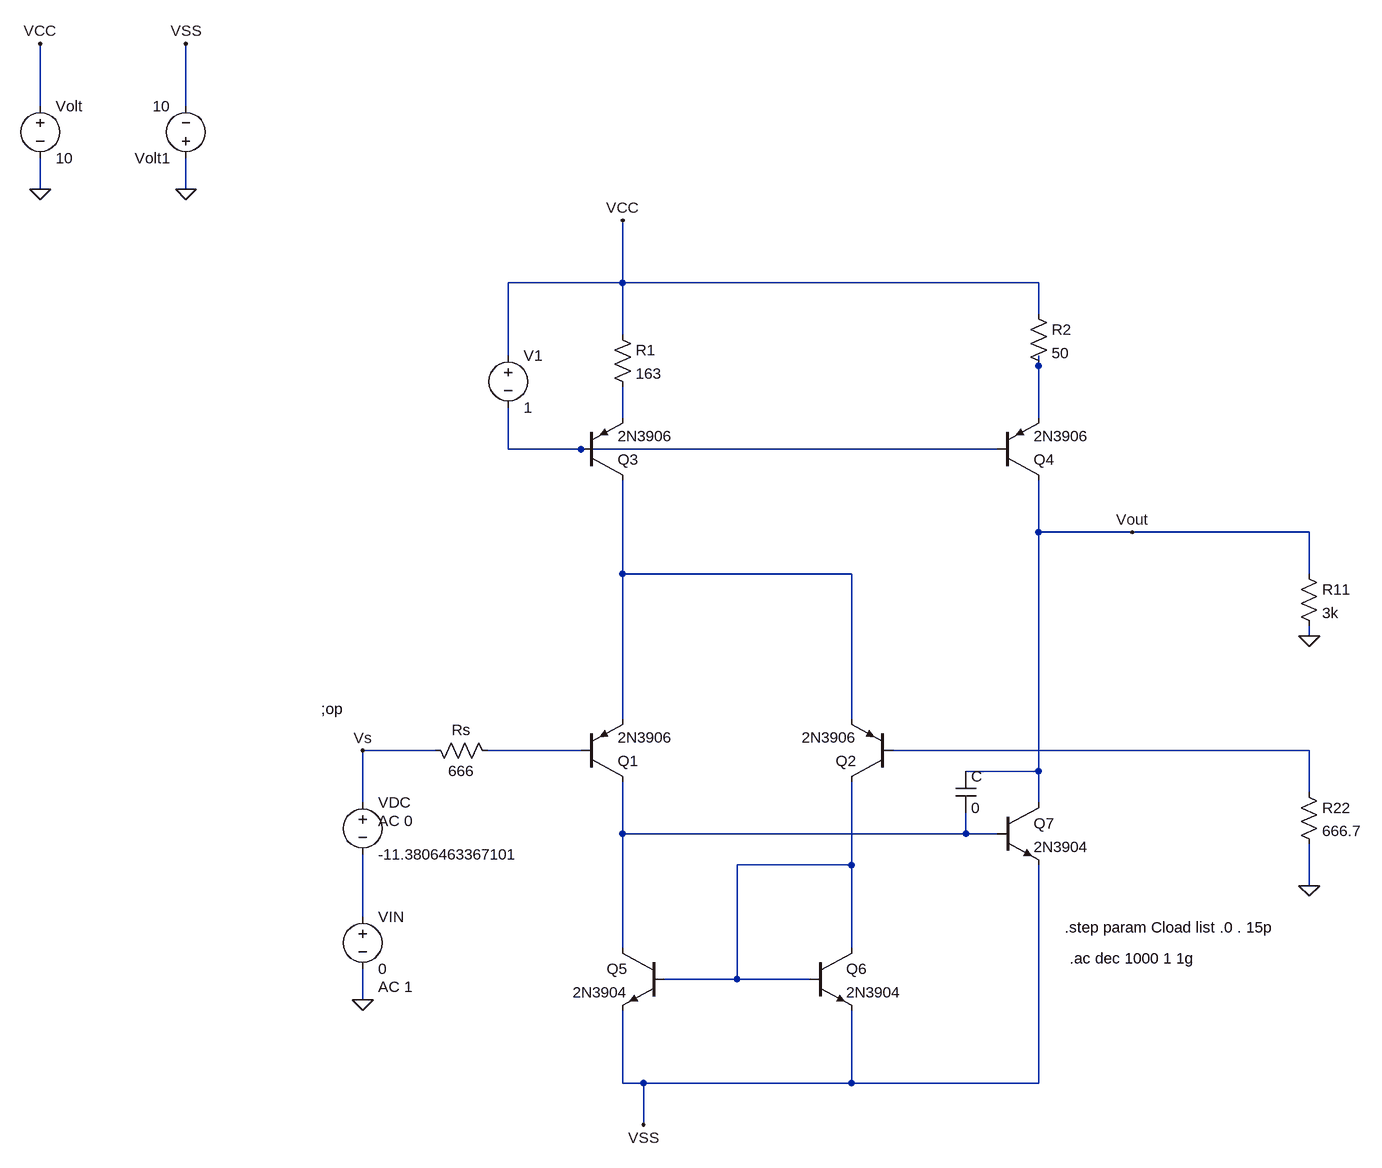
[diagram p0: schematic ASK3_open_loop.asc]
ASK3_open_loop.asc, the LTspice schematic file:
Version 4
SHEET 1 3348 680
WIRE -1056 -1232 -1056 -1328
WIRE -832 -1232 -832 -1328
WIRE -1056 -1104 -1056 -1152
WIRE -832 -1104 -832 -1152
WIRE -160 -960 -160 -1056
WIRE -160 -960 -336 -960
WIRE 480 -960 -160 -960
WIRE 480 -912 480 -960
WIRE -160 -880 -160 -960
WIRE -336 -848 -336 -960
WIRE 480 -832 480 -848
WIRE -160 -752 -160 -800
WIRE 480 -752 480 -832
WIRE -336 -704 -336 -768
WIRE -224 -704 -336 -704
WIRE 416 -704 -224 -704
WIRE 480 -576 480 -656
WIRE 624 -576 480 -576
WIRE 896 -576 624 -576
WIRE -160 -512 -160 -656
WIRE 192 -512 -160 -512
WIRE 896 -512 896 -576
WIRE 896 -416 896 -432
WIRE 896 -416 880 -416
WIRE -160 -288 -160 -512
WIRE 192 -288 192 -512
WIRE -448 -240 -560 -240
WIRE -224 -240 -368 -240
WIRE 896 -240 256 -240
WIRE 480 -208 480 -576
WIRE 480 -208 368 -208
WIRE 896 -176 896 -240
WIRE -560 -160 -560 -240
WIRE 480 -160 480 -208
WIRE -160 -112 -160 -192
WIRE 368 -112 368 -144
WIRE 368 -112 -160 -112
WIRE 416 -112 368 -112
WIRE 192 -64 192 -192
WIRE 192 -64 16 -64
WIRE 896 -32 896 -96
WIRE -560 16 -560 -80
WIRE -160 64 -160 -112
WIRE 192 64 192 -64
WIRE 16 112 16 -64
WIRE 16 112 -96 112
WIRE 128 112 16 112
WIRE -560 144 -560 96
WIRE -160 272 -160 160
WIRE -128 272 -160 272
WIRE 192 272 192 160
WIRE 192 272 -128 272
WIRE 480 272 480 -64
WIRE 480 272 192 272
WIRE -128 336 -128 272
FLAG -160 -1056 VCC
FLAG -560 144 0
FLAG -128 336 VSS
FLAG 896 -32 0
FLAG 624 -576 Vout
FLAG -1056 -1104 0
FLAG -1056 -1328 VCC
FLAG -832 -1104 0
FLAG -832 -1328 VSS
FLAG -560 -240 Vs
FLAG 896 -416 0
SYMBOL npn 128 64 R0
SYMATTR InstName Q6
SYMATTR Value 2N3904
SYMBOL npn -96 64 M0
SYMATTR InstName Q5
SYMATTR Value 2N3904
SYMBOL pnp 256 -192 R180
SYMATTR InstName Q2
SYMATTR Value 2N3906
SYMBOL pnp -224 -192 M180
SYMATTR InstName Q1
SYMATTR Value 2N3906
SYMBOL res -464 -256 M90
WINDOW 0 0 56 VBottom 2
WINDOW 3 32 56 VTop 2
SYMATTR InstName Rs
SYMATTR Value 666
SYMBOL pnp -224 -656 M180
SYMATTR InstName Q3
SYMATTR Value 2N3906
SYMBOL res -176 -896 R0
SYMATTR InstName R1
SYMATTR Value 163
SYMBOL voltage -336 -864 R0
WINDOW 123 0 0 Left 0
WINDOW 39 0 0 Left 0
SYMATTR InstName V1
SYMATTR Value 1
SYMBOL pnp 416 -656 M180
SYMATTR InstName Q4
SYMATTR Value 2N3906
SYMBOL res 464 -928 R0
SYMATTR InstName R2
SYMATTR Value 50
SYMBOL voltage -560 -176 R0
WINDOW 123 24 44 Left 2
WINDOW 39 0 0 Left 0
SYMATTR Value2 AC 0
SYMATTR InstName VDC
SYMATTR Value -11.3806463367101
SYMBOL voltage -560 0 R0
WINDOW 123 24 124 Left 2
WINDOW 39 0 0 Left 0
SYMATTR Value2 AC 1
SYMATTR InstName VIN
SYMATTR Value 0
SYMBOL npn 416 -160 R0
SYMATTR InstName Q7
SYMATTR Value 2N3904
SYMBOL res 880 -528 R0
SYMATTR InstName R11
SYMATTR Value 3k
SYMBOL res 880 -192 R0
SYMATTR InstName R22
SYMATTR Value 666.7
SYMBOL cap 352 -208 R0
SYMATTR InstName C
SYMATTR Value 0
SYMBOL voltage -1056 -1248 R0
WINDOW 123 0 0 Left 0
WINDOW 39 0 0 Left 0
SYMATTR InstName Volt
SYMATTR Value 10
SYMBOL voltage -832 -1136 R180
WINDOW 123 0 0 Left 0
WINDOW 39 0 0 Left 0
SYMATTR InstName Volt1
SYMATTR Value 10
TEXT 520 32 Left 2 !.step param Cload list .0 . 15p
TEXT -624 -304 Left 2 !;op
TEXT 528 80 Left 2 !.ac dec 1000 1 1g

The netlist it stands for:
* ASK3_open_loop.asc
Q6 N008 N008 VSS 0 2N3904
Q5 N007 N008 VSS 0 2N3904
Q2 N008 N006 N004 0 2N3906
Q1 N007 N005 N004 0 2N3906
Rs Vs N005 666
Q3 N004 N003 N002 0 2N3906
R1 VCC N002 163
V1 VCC N003 1
Q4 Vout N003 N001 0 2N3906
R2 VCC N001 50
VDC Vs N009 -11.3806463367101 AC 0
VIN N009 0 0 AC 1
Q7 Vout N007 VSS 0 2N3904
R11 Vout 0 3k
R22 N006 0 666.7
C Vout N007 0
Volt VCC 0 10
Volt1 0 VSS 10
.model NPN NPN
.model PNP PNP
.lib standard.bjt
.step param Cload list .0 . 15p
;op
.ac dec 1000 1 1g
.backanno
.end